# EAGLE design l1-logo_profiled (EAGLE 9.4.0)
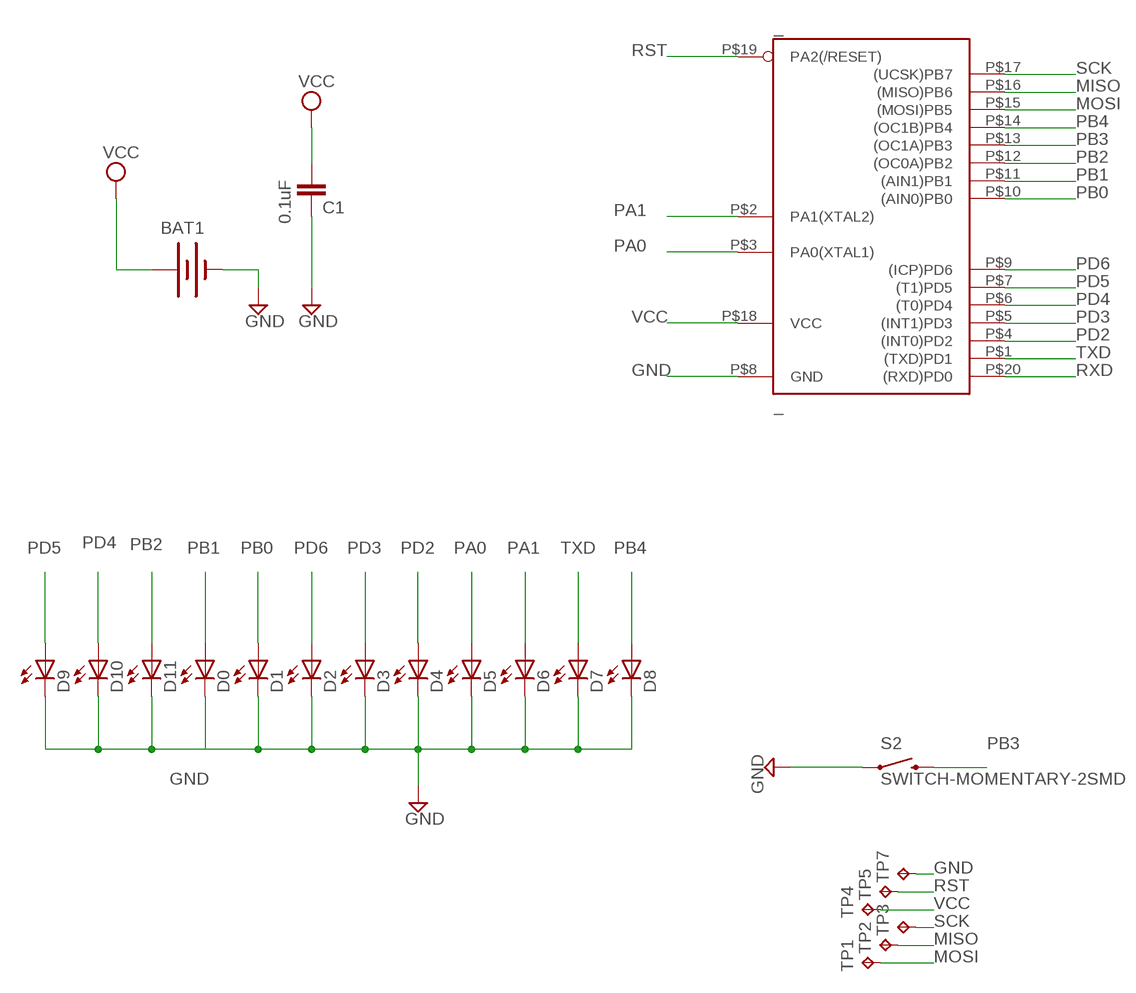
[diagram p0: schematic, sheet 1]

## Parts
_  _  TINY2313-*M*  [MLF20]
BAT1  SPARKFUN_BATTERYSPARKFUN_BATTCOMM_20MM_LINX  [SPARKFUN_BATTCOM_20MM_LINX]
C1  0.1uF  CAP0805  [0805]
D0  SPARKFUN_LED1206  [SPARKFUN_LED-1206]
D1  SPARKFUN_LED1206  [SPARKFUN_LED-1206]
D2  SPARKFUN_LED1206  [SPARKFUN_LED-1206]
D3  SPARKFUN_LED1206  [SPARKFUN_LED-1206]
D4  SPARKFUN_LED1206  [SPARKFUN_LED-1206]
D5  SPARKFUN_LED1206  [SPARKFUN_LED-1206]
D6  SPARKFUN_LED1206  [SPARKFUN_LED-1206]
D7  SPARKFUN_LED1206  [SPARKFUN_LED-1206]
D8  SPARKFUN_LED1206  [SPARKFUN_LED-1206]
D9  SPARKFUN_LED1206  [SPARKFUN_LED-1206]
D10  SPARKFUN_LED1206  [SPARKFUN_LED-1206]
D11  SPARKFUN_LED1206  [SPARKFUN_LED-1206]
S2  SWITCH-MOMENTARY-2SMD  [TACTILE_SWITCH_SMD]
TP1  TPTP18R  [TP18R]
TP2  TPTP18R  [TP18R]
TP3  TPTP18R  [TP18R]
TP4  TPTP18R  [TP18R]
TP5  TPTP18R  [TP18R]
TP7  TPTP18R  [TP18R]

## Nets
GND [power]: _.P$8(GND) BAT1.2(-) C1.2 D0.C D1.C D2.C D3.C D4.C D5.C D6.C D7.C D8.C D9.C D10.C D11.C S2.1 TP7.TP
MISO: _.P$16((MISO)PB6) TP2.TP
MOSI: _.P$15((MOSI)PB5) TP1.TP
PA0: _.P$3(PA0(XTAL1)) D5.A
PA1: _.P$2(PA1(XTAL2)) D6.A
PB0: _.P$10((AIN0)PB0) D1.A
PB1: _.P$11((AIN1)PB1) D0.A
PB2: _.P$12((OC0A)PB2) D11.A
PB3: _.P$13((OC1A)PB3) S2.3
PB4: _.P$14((OC1B)PB4) D8.A
PD2: _.P$4((INT0)PD2) D4.A
PD3: _.P$5((INT1)PD3) D3.A
PD4: _.P$6((T0)PD4) D10.A
PD5: _.P$7((T1)PD5) D9.A
PD6: _.P$9((ICP)PD6) D2.A
RST: _.P$19(PA2(/RESET)) TP5.TP
RXD: _.P$20((RXD)PD0)
SCK: _.P$17((UCSK)PB7) TP3.TP
TXD: _.P$1((TXD)PD1) D7.A
VCC [power]: _.P$18(VCC) BAT1.1(+) C1.1 TP4.TP

## Library data of the parts
_ = NSL_Cylon:TINY2313*: Atmel Tiny2313 2K Flash, 128 bytes EEPROM, 128 bytes RAM
BAT1 = NSL:SPARKFUN_BATTERY: Battery Holders Various common sizes : AA, AAA, 20mm coin cell and 12mm coin cell.
C1 = SparkFun:CAP: Capacitor Standard 0603 ceramic capacitor, and 0.1" leaded capacitor.
D0 D1-D11 = NSL:SPARKFUN_LED: LEDs Standard schematic elements and footprints for 5mm, 3mm, 1206, and 0603 sized LEDs. 5mm - Spark Fun Electronics SKU : COM-00529 (and others)
S2 = SparkFun:SWITCH-MOMENTARY-2
TP1-TP5 TP7 = testpad:TP: Test pad

## Net classes
1 power: width 0.254 mm
2 leds: width 0.508 mm

## Board
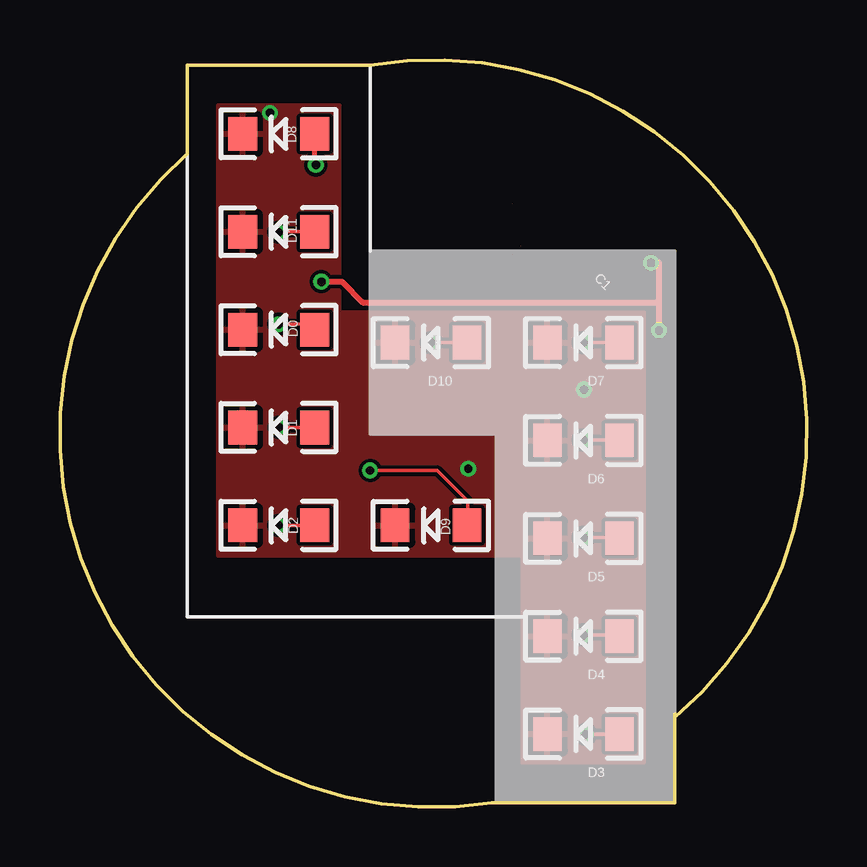
[diagram p1: board, top side]
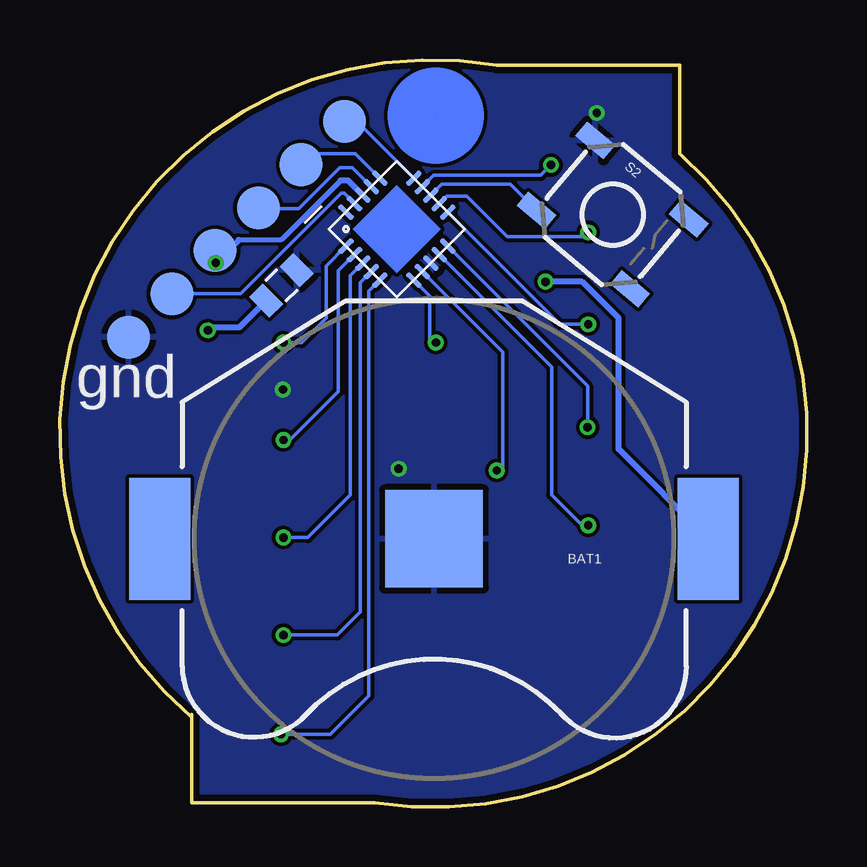
[diagram p2: board, bottom side, seen from below]

Size 31.12 x 31.14 mm. Coordinates in mm from the lower left corner, seen from the top.
Outline: 25.62,3.74 25.62,0.19 18,0.19 arc-148 5.3,27.24 5.3,30.92 12.92,30.92 arc-150 25.62,3.74
Outline: 25.62,3.74 25.62,3.87
Copper layers (1*16): Top 0.035mm / dielectric 1.5mm / Bottom 0.035mm
Design rules "ITead_rule": minimum track width 6mil, minimum drill 12mil, track to track 6mil, track to pad 6mil, pad to pad 6mil, via to via 6mil, smd to smd 0mil, copper to edge 10mil, drill to drill 10mil, minimum pad ring 10mil, minimum via ring 6mil, stop-mask expansion 2mil, vias tented up to drill 100mil, thermal gap 10mil

### Footprints (pad centres in the part's own frame; a part is rotated, then mirrored left to right if it is on the bottom)
MLF20 = smd 0.8 x 0.23: P$1 -2,1; P$2 -2,0.5; P$3 -2,0; P$4 -2,-0.5; P$5 -2,-1; P$11 2,-1; P$12 2,-0.5; P$13 2,0; P$14 2,0.5; P$15 2,1 | smd 0.23 x 0.8: P$6 -1,-2; P$7 -0.5,-2; P$8 0,-2; P$9 0.5,-2; P$10 1,-2; P$16 1,2; P$17 0.5,2; P$18 0,2; P$19 -0.5,2; P$20 -1,2
SPARKFUN_BATTCOM_20MM_LINX = smd 2.54 x 5.08: 1 -11.43,0; 3 11.43,0 | smd 4.064 x 4.064: 2 0,0
0805 = smd 0.8 x 1.2: 1 -0.9,0; 2 0.9,0
SPARKFUN_LED-1206 = smd 1.2 x 1.4: A -1.5,0; C 1.5,0
TACTILE_SWITCH_SMD = smd 1.524 x 0.762: 1 -2.54,1.905; 2 2.54,1.905; 3 -2.54,-1.905; 4 2.54,-1.905
TP18R = smd 1.8 x 1.8: TP 0,0

### Placement (x,y rotation side)
_  17.08,24.09 45 bottom
BAT1  15.54,11.18 180 bottom
C1  21.9,21.75 45 bottom
D0  9.11,19.9 180 top
D1  9.11,15.82 180 top
D2  9.11,11.74 180 top
D3  21.81,3.04 180 top
D4  21.81,7.12 180 top
D5  21.81,11.2 180 top
D6  21.81,15.28 180 top
D7  21.81,19.36 180 top
D8  9.11,28.06 180 top
D9  15.46,11.74 180 top
D10  15.46,19.36 180 top
D11  9.11,23.98 180 top
S2  8.09,24.7 320 bottom
TP1  19.27,28.58 0 bottom
TP2  21.07,26.78 0 bottom
TP3  22.85,24.98 0 bottom
TP4  24.65,23.2 0 bottom
TP5  26.46,21.39 0 bottom
TP7  28.26,19.59 0 bottom

### Tracks (layer width: path | path; a pad name or v marks a point on that pad's centre or on a via)
GND  (via drill 0.35)
  other vias: 17.01,14.1 21.83,17.41 8.75,28.94
  pour Bottom: -3.59,37.14 -3.59,-2.23 33.24,-2.23 33.24,37.14
  pour Top: 6.57,29.27 6.57,10.47 19.27,10.47 19.27,1.84 24.35,1.84 24.35,20.63 11.65,20.63 11.65,29.27
MISO
  Bottom 0.152: _.P$16 18.82,27.24 20.62,27.24 TP2.TP
MOSI
  Bottom 0.152: _.P$15 18.75,28.58 TP1.TP
PA0  (via drill 0.35)
  Top 0.152: v21.81,11.23 23.28,11.23 D5.A
  Bottom 0.152: _.P$3 19.02,22.16 19.02,13.01 20.79,11.23 v21.81,11.23
PA1  (via drill 0.35)  (1 unrouted)
  Top 0.152: v21.81,15.3 23.29,15.3 D6.A
  Bottom 0.152: _.P$2 19.52,22.36 19.52,17.33 21.56,15.3 v21.81,15.3
PB0  (via drill 0.35)
  Top 0.152: D1.A v9.14,15.82 v9.13,15.83
  Bottom 0.152: _.P$10 9.13,17.56 v9.13,15.83
PB1  (via drill 0.35)
  Top 0.152: v9.11,20.12 10.39,20.12 D0.A
  Bottom 0.152: v9.11,20.12 10.29,20.12 _.P$11
PB2  (via drill 0.35)
  Top 0.152: v9.11,23.96 9.13,23.98 D11.A
  Bottom 0.152: _.P$12 15.01,25.46 14.16,25.46 12.48,23.78 9.38,23.78 9.17,23.99 9.11,23.99 v9.11,23.96
PB3  (1 unrouted)
  Bottom 0.152: _.P$13 15.21,25.97 12.36,25.97 S2.3
PB4  (via drill 0.35)
  Top 0.152: D8.A 10.66,28.01
  Top 0.203: v10.66,26.77 10.61,26.82 D8.A
  Bottom 0.152: _.P$14 15.54,26.34 11.09,26.34 v10.66,26.77
PD2  (via drill 0.35)
  Top 0.152: v21.81,7.17 23.26,7.17 D4.A
  Bottom 0.152: _.P$4 18.61,21.86 18.61,8.14 19.57,7.17 v21.81,7.17
PD3  (via drill 0.35)
  Top 0.152: D3.A 23.3,3.03 v21.91,3.03
  Bottom 0.152: _.P$5 18.25,21.51 18.25,4.63 19.85,3.03 v21.91,3.03
PD4  (via drill 0.35)
  Top 0.152: v15.46,19.36 D10.A
  Bottom 0.152: _.P$6 15.71,21.31 15.71,19.36 v15.46,19.36
PD5  (via drill 0.35)
  Top 0.152: v12.92,14.03 15.71,14.03 16.98,12.76 16.98,11.77 D9.A
  Bottom 0.152: _.P$7 12.67,18.97 12.67,14.03 v12.92,14.03
PD6  (via drill 0.35)
  Top 0.152: v9.11,11.74 D2.A
  Bottom 0.152: _.P$9 10.63,18.35 10.63,13.01 9.36,11.74 v9.11,11.74
RST  (1 unrouted)
  Bottom 0.152: _.P$19 19.29,25.59 19.4,25.59 23.59,21.39 TP5.TP
SCK
  Bottom 0.152: _.P$17 18.94,26.65 19.47,26.65 21.17,24.95 22.83,24.95 TP3.TP
TXD  (via drill 0.35)  (1 unrouted)
  Top 0.152: v21.81,19.36 D7.A
  Bottom 0.152: _.P$1 20.03,22.56 20.03,20.38 21.05,19.36 v21.81,19.36
VCC  (via drill 0.35)
  Top 0.254: v24.96,19.87 24.96,21.14 | 24.96,21.14 24.96,22.69 v24.63,22.69 | v10.89,21.9 11.75,21.9 12.61,21.04 24.86,21.04 24.96,21.14
  Bottom 0.203: 19.43,26.12 21.9,23.64 23.67,23.64
  Bottom 0.254: _.P$18 19.11,26.12 19.43,26.12 | 23.67,23.64 24.5,22.82 | 24.5,22.82 v24.63,22.69 | C1.1 23.65,20 24.96,20 v24.96,19.87 | BAT1.1 7.84,14.92 7.84,20.38 9.36,21.9 v10.89,21.9 | TP4.TP 24.65,22.97 24.5,22.82
(copper drawn outside any net)
  shapes: Bottom circle x1

### Text on the board
bNames: gnd